# EAGLE design cerebellar V1.0 (EAGLE 9.6.2)
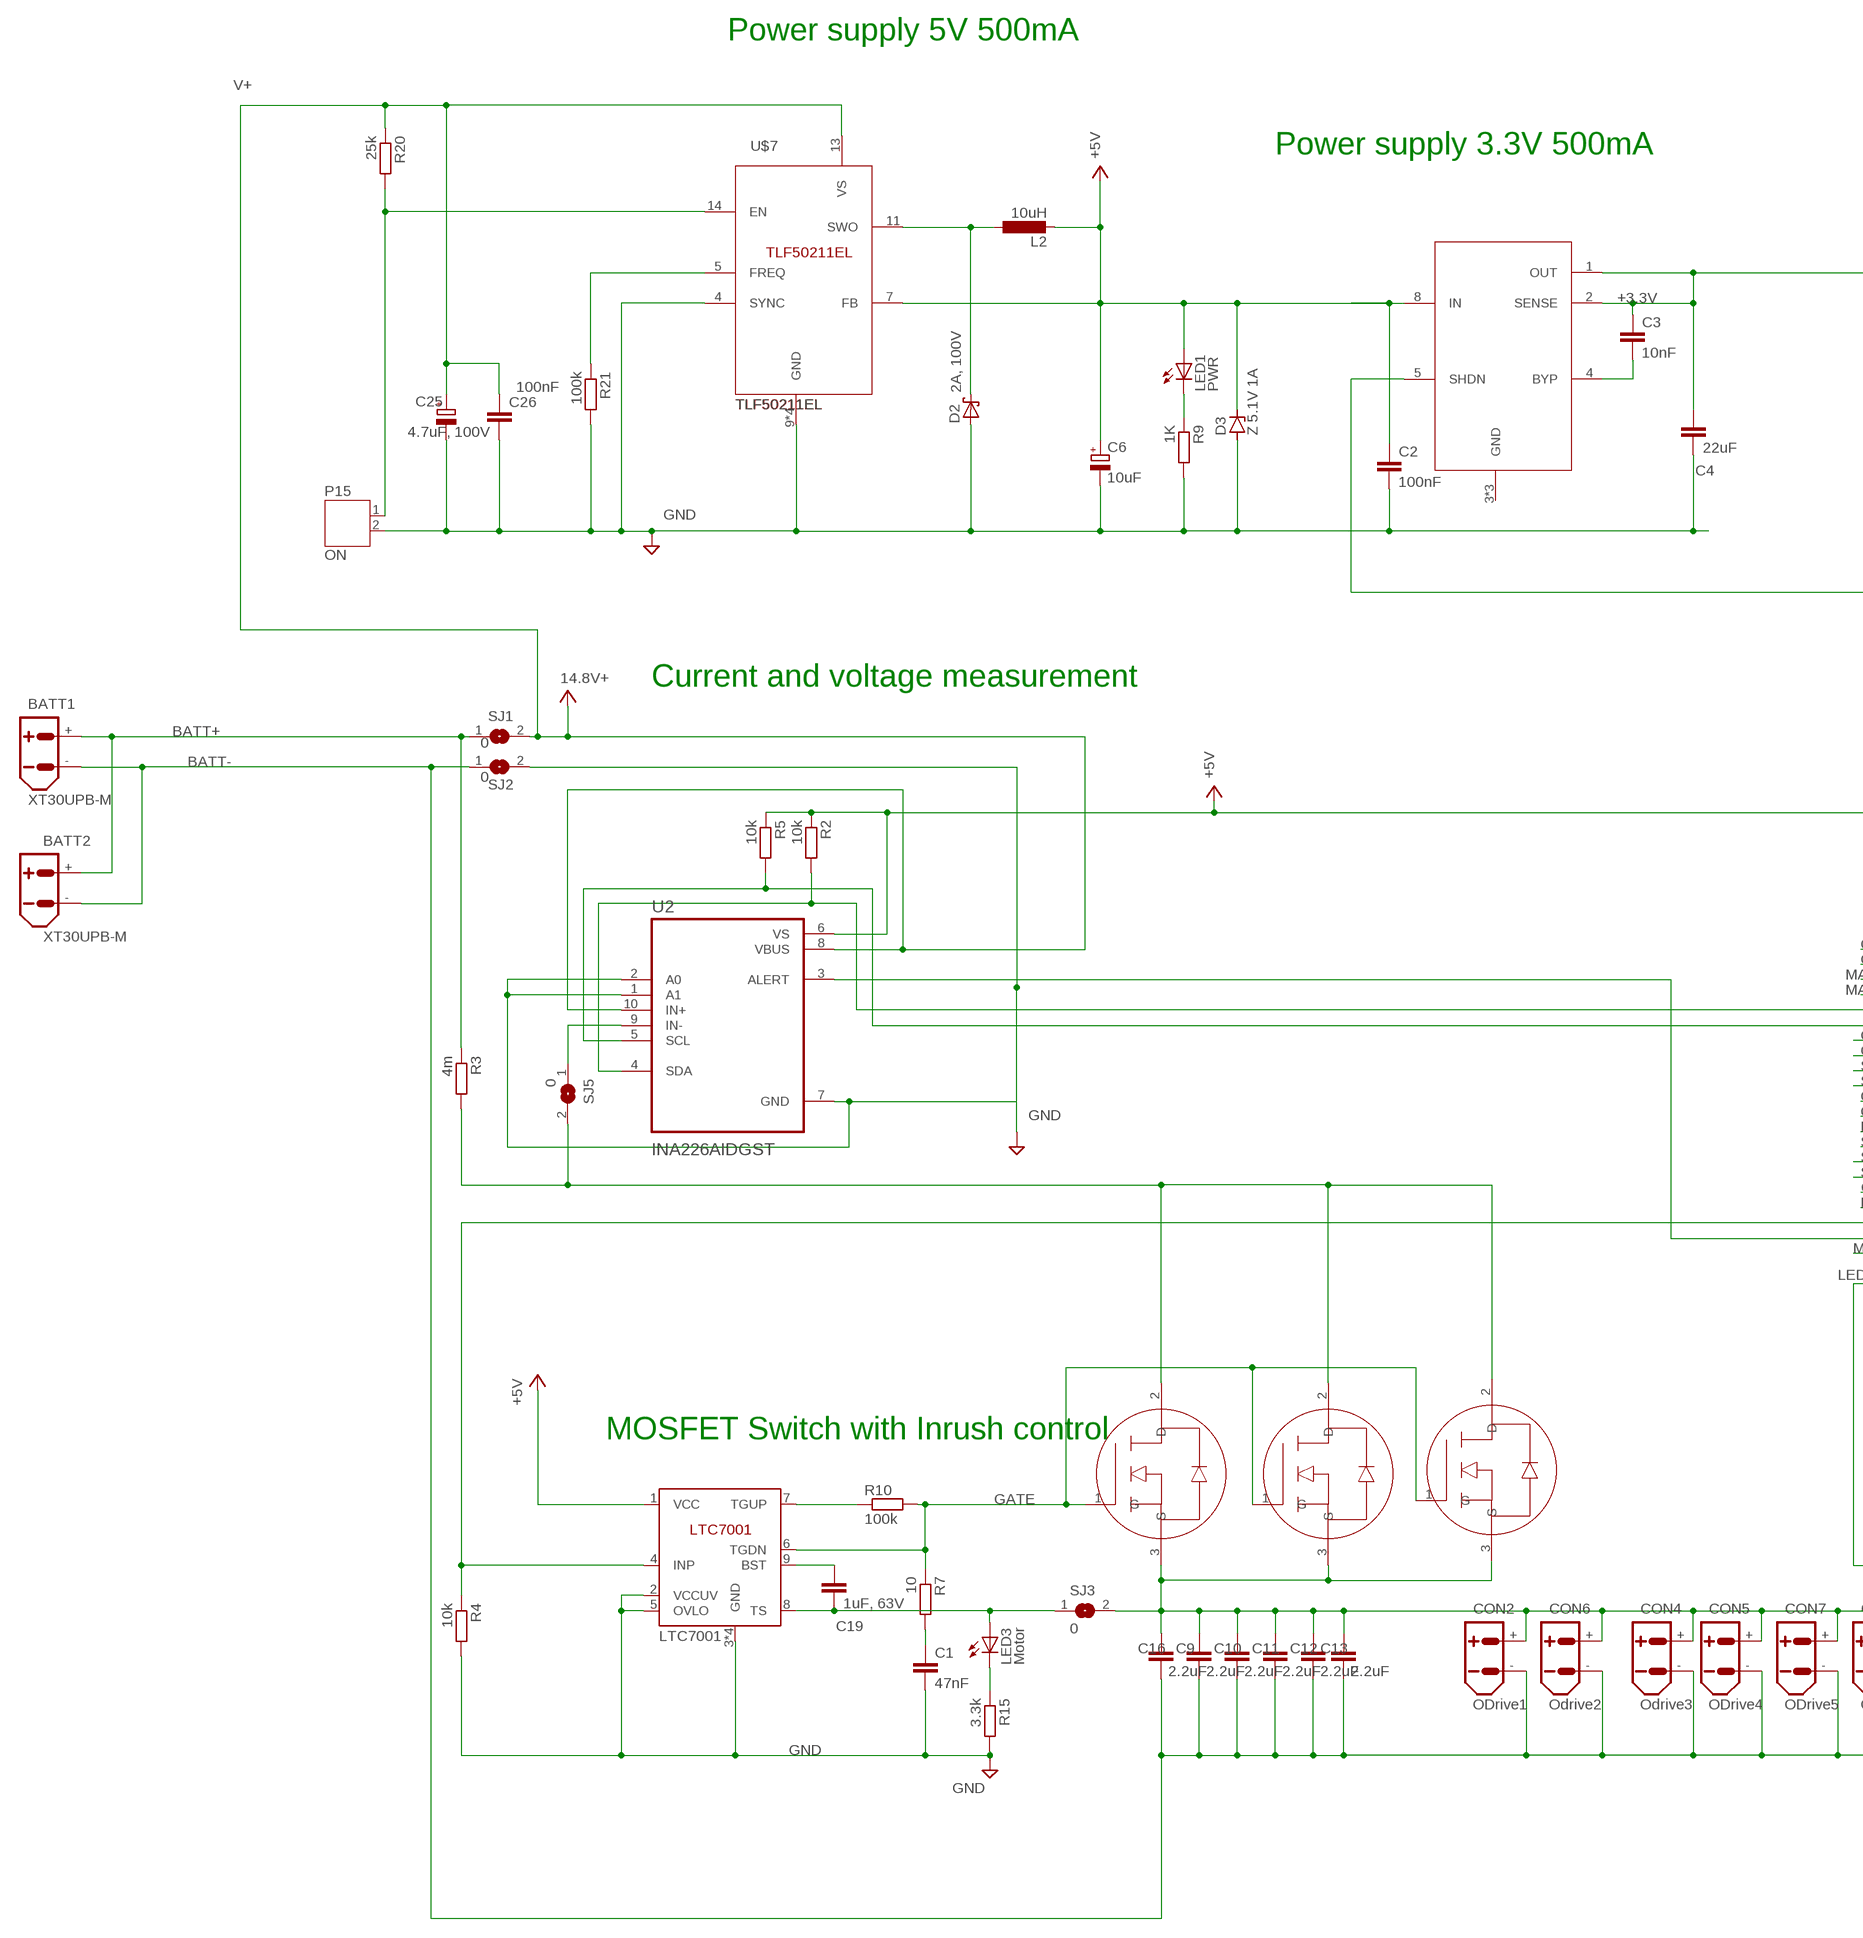
[diagram p0: schematic, sheet 1, part 1 of 2]
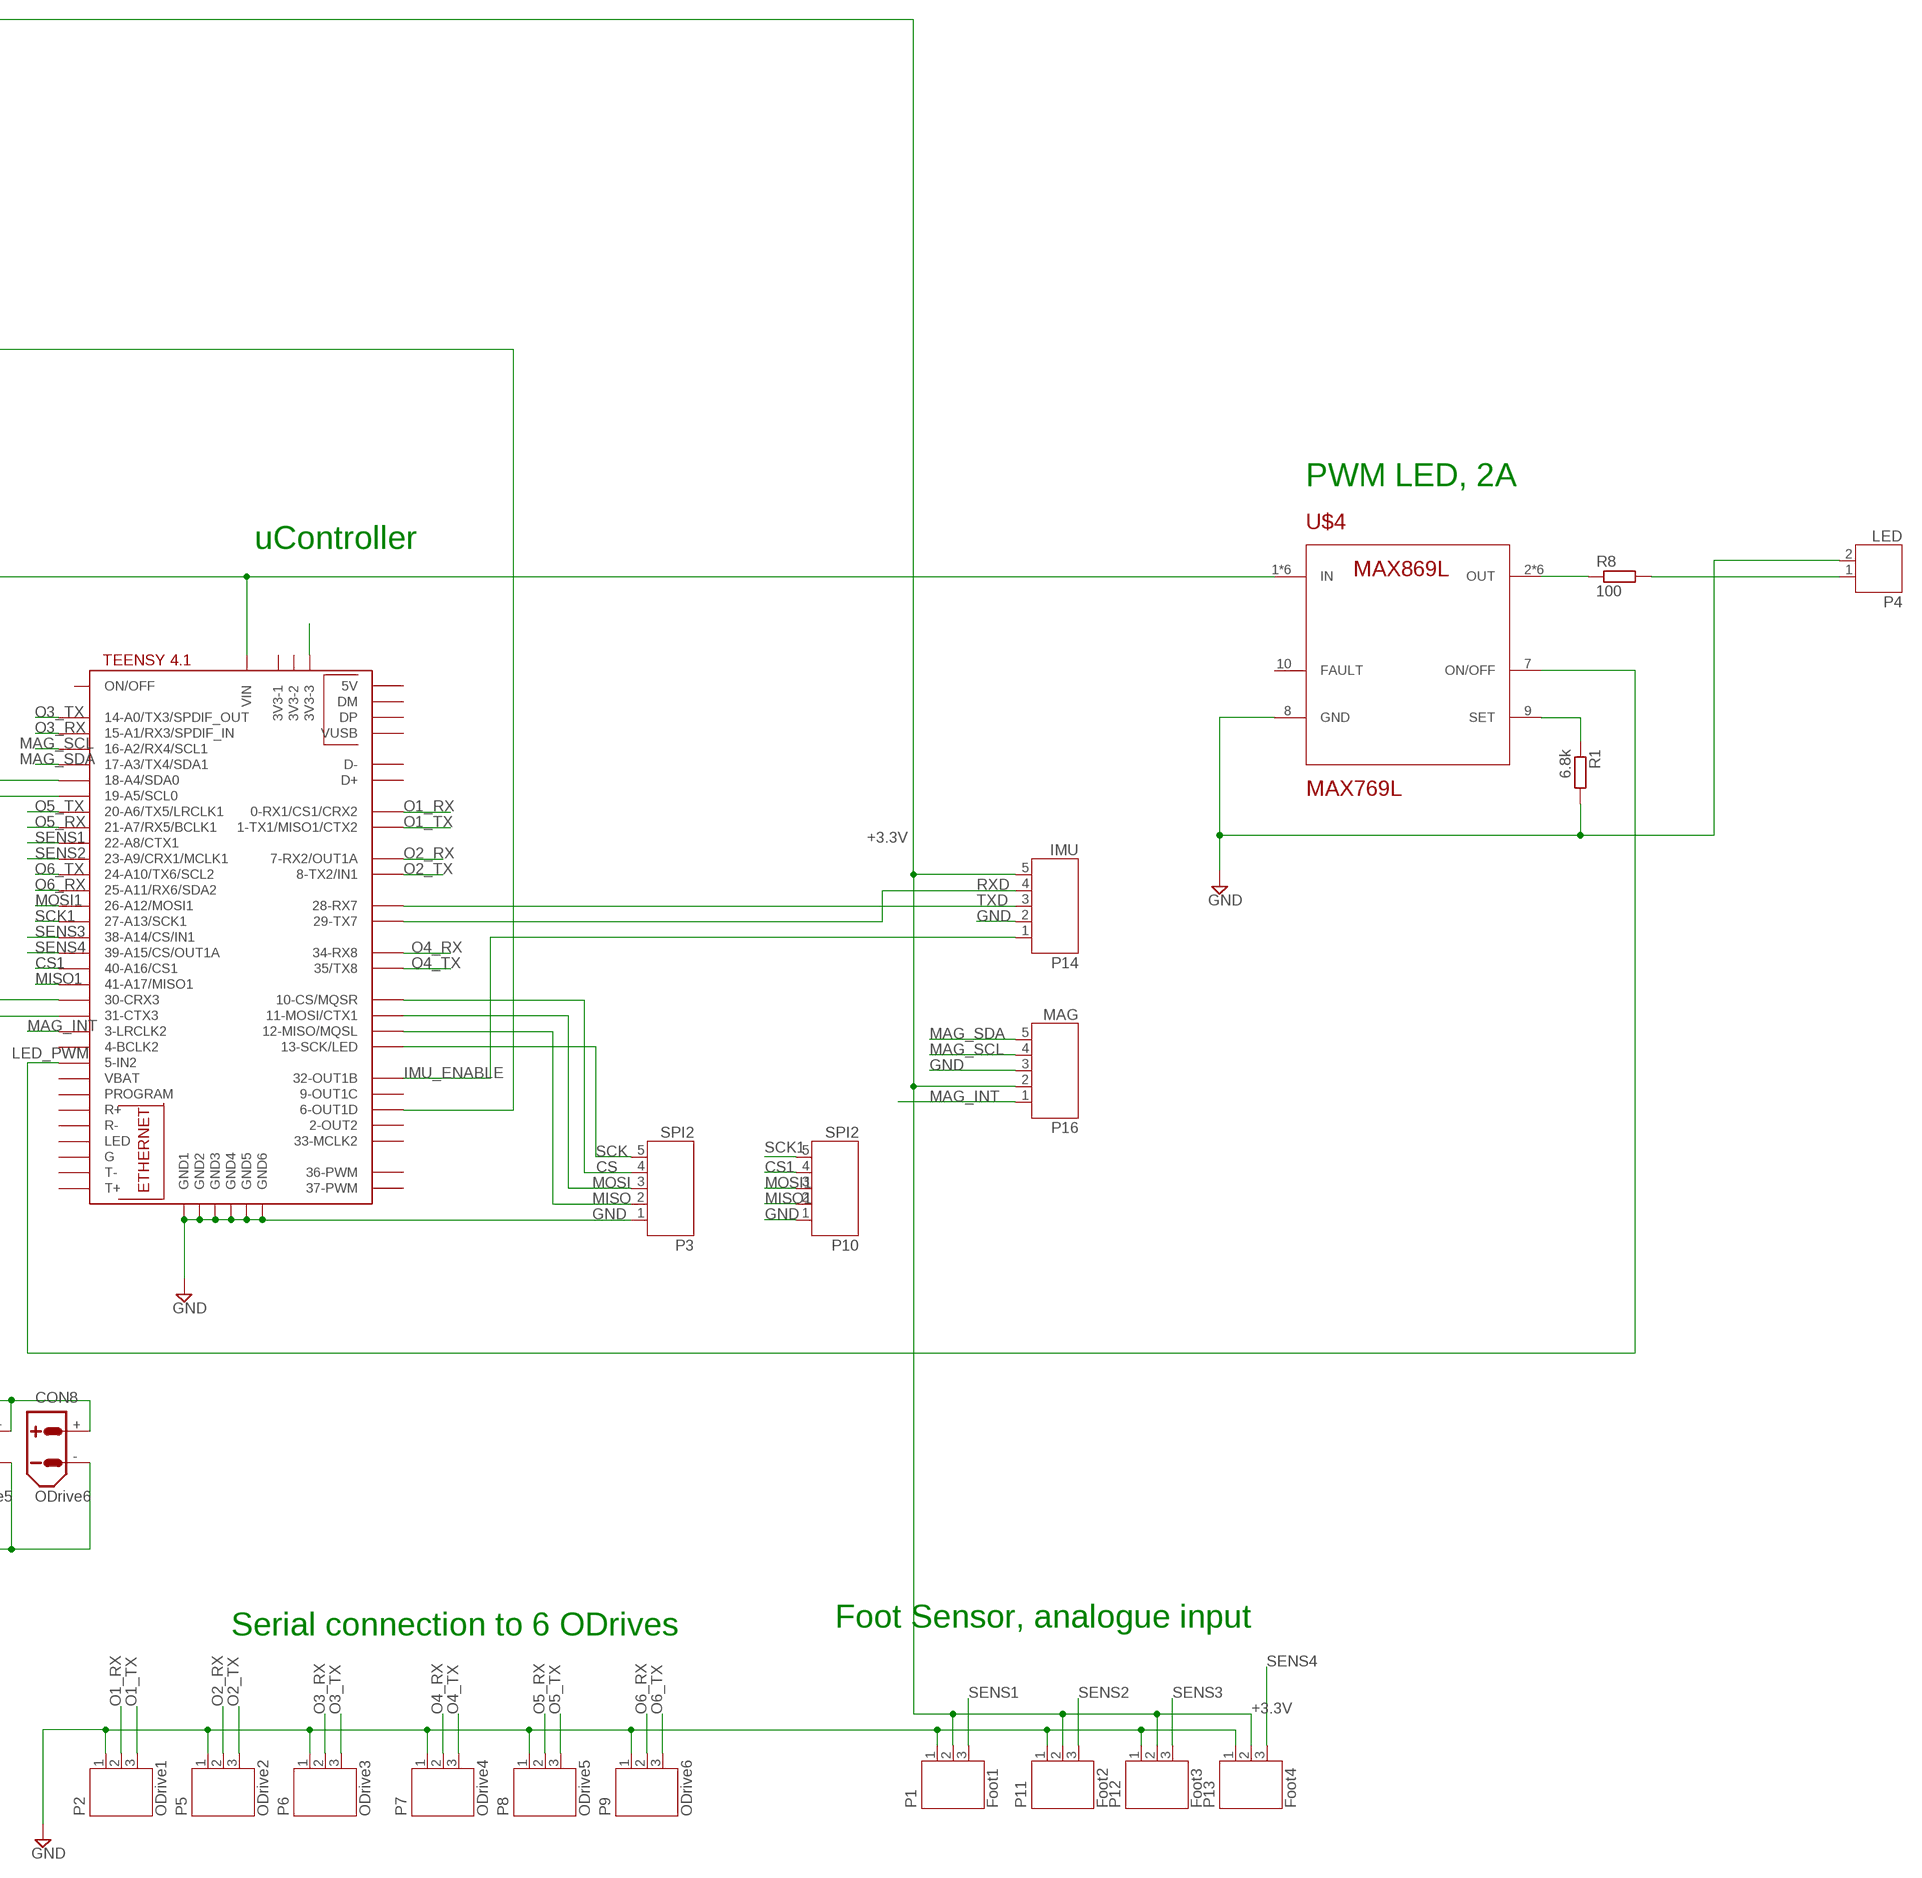
[diagram p1: schematic, sheet 1, part 2 of 2]

## Parts
BATT1  XT30UPB-M  [XT30UPB-M]
BATT2  XT30UPB-M  [XT30UPB-M]
C1  47nF  C-EU025-025X050  [C025-025X050]
C2  100nF  C-EU025-025X050  [C025-025X050]
C3  10nF  C-EU025-025X050  [C025-025X050]
C4  22uF  C-EU025-025X050  [C025-025X050]
C6  10uF  CPOL-EUE2-4  [E2-4]
C9  2.2uF  C-EU050-024X044  [C050-024X044]
C10  2.2uF  C-EU050-024X044  [C050-024X044]
C11  2.2uF  C-EU050-024X044  [C050-024X044]
C12  2.2uF  C-EU050-024X044  [C050-024X044]
C13  2.2uF  C-EU050-024X044  [C050-024X044]
C16  2.2uF  C-EU050-024X044  [C050-024X044]
C19  1uF, 63V  C-EU025-025X050  [C025-025X050]
C25  4.7uF, 100V  CPOL-EUE2-4  [E2-4]
C26  100nF  C-EU050-024X044  [C050-024X044]
CON2  ODrive1  XT30UPB-M  [XT30UPB-M]
CON4  Odrive3  XT30UPB-M  [XT30UPB-M]
CON5  ODrive4  XT30UPB-M  [XT30UPB-M]
CON6  Odrive2  XT30UPB-M  [XT30UPB-M]
CON7  ODrive5  XT30UPB-M  [XT30UPB-M]
CON8  ODrive6  XT30UPB-M  [XT30UPB-M]
D2  2A, 100V  SCHOTTKY-DIODEDO41  [DO41-10]
D3  Z 5.1V 1A  ZENER-DIODEDO41Z10  [DO41Z10]
IC3  LTC7001  [MSOP10]
L2  10uH  L-EUIRF-3  [IRF-3]
LED1  PWR  LED3MM  [LED3MM]
LED3  Motor  LED3MM  [LED3MM]
P1  Foot1  JST-PH3  [JST-PH3]
P2  ODrive1  JST-PH3  [JST-PH3]
P3  SPI2  JST-PH5  [JST-PH5]
P4  LED  JST-PH2  [JST-PH2]
P5  ODrive2  JST-PH3  [JST-PH3]
P6  ODrive3  JST-PH3  [JST-PH3]
P7  ODrive4  JST-PH3  [JST-PH3]
P8  ODrive5  JST-PH3  [JST-PH3]
P9  ODrive6  JST-PH3  [JST-PH3]
P10  SPI2  JST-PH5  [JST-PH5]
P11  Foot2  JST-PH3  [JST-PH3]
P12  Foot3  JST-PH3  [JST-PH3]
P13  Foot4  JST-PH3  [JST-PH3]
P14  IMU  JST-PH5  [JST-PH5]
P15  ON  JST-PH2  [JST-PH2]
P16  MAG  JST-PH5  [JST-PH5]
R1  6.8k  R-EU_0204/7  [0204/7]
R2  10k  R-EU_0204/7  [0204/7]
R3  4m  R-EU_R2512  [R2512]
R4  10k  R-EU_0204/7  [0204/7]
R5  10k  R-EU_0204/7  [0204/7]
R7  10  R-EU_0204/7  [0204/7]
R8  100  R-EU_0204/7  [0204/7]
R9  1K  R-EU_0204/7  [0204/7]
R10  100k  R-EU_0204/7  [0204/7]
R15  3.3k  R-EU_0204/7  [0204/7]
R20  25k  R-EU_0204/7  [0204/7]
R21  100k  R-EU_0204/7  [0204/7]
SJ1  0  SJ  [SJ]
SJ2  0  SJ  [SJ]
SJ3  0  SJ  [SJ]
SJ5  0  SJ  [SJ]
U2  INA226AIDGST  [SOP50P490X110-10N]
U$1  TEENSY41  [TEENSY41]
U$2  IRF2804  [TO-220H]
U$3  IRF2804  [TO-220H]
U$4  MAX769L  [TSSOP-16]
U$5  IRF2804  [TO-220H]
U$7  TLF50211EL  [TSSOP-14]
U$8  LT1763  [SO08]

## Nets
+3.3V: C3.1 C4.1 P1.2 P11.2 P12.2 P13.2 P14.5 P16.2 U$8.1(OUT) U$8.2(SENSE)
+5V: C2.1 C6.+ D3.C IC3.1(VCC) L2.2 LED1.A R2.1 R5.1 U2.6(VS) U$1.VIN U$4.1(IN) U$4.4(IN) U$4.5(IN) U$4.12(IN) U$4.13(IN) U$4.16(IN) U$7.7(FB) U$8.8(IN)
BATT+ [Battery]: BATT1.+ BATT2.+ R3.1 SJ1.1
BATT- [Battery]: BATT1.- BATT2.- C9.2 C10.2 C11.2 C12.2 C13.2 C16.2 CON2.- CON4.- CON5.- CON6.- CON7.- CON8.- SJ2.1
CS: P3.4 U$1.10-CS\MQSR(10-CS/MQSR)
CS1: P10.4 U$1.40-A16/CS1
DRAIN [Battery]: R3.2 SJ5.2 U$2.2(D) U$3.2(D) U$5.2(D)
GATE: IC3.6(TGDN) R7.1 R10.2 U$2.1(G) U$3.1(G) U$5.1(G)
GND: C1.2 C2.2 C4.2 C6.- C25.- C26.2 D2.A D3.A IC3.2(VCCUV) IC3.3(GND) IC3.5(OVLO) IC3.10(GND) IC3.11(GND) IC3.12(GND) P1.1 P2.1 P3.1 P4.2 P5.1 P6.1 P7.1 P8.1 P9.1 P10.1 P11.1 P12.1 P13.1 P14.2 P15.2 P16.3 R1.2 R4.2 R9.2 R15.2 R21.2 SJ2.2 U2.1(A1) U2.2(A0) U2.7(GND) U$1.GND1 U$1.GND2 U$1.GND3 U$1.GND4 U$1.GND5 U$1.GND6 U$4.8(GND) U$7.4(SYNC) U$7.9(GND) U$7.10(GND) U$7.15(GND) U$7.16(GND)
IMU_ENABLE: P14.1 U$1.32-OUT1B
LED_PWM: U$1.5-IN2 U$4.7(ON/OFF)
MAG_INT: P16.1 U$1.3-LRCLK2
MAG_SCL: P16.4 U$1.16-A2/RX4/SCL1
MAG_SDA: P16.5 U$1.17-A3/TX4/SDA1
MISO: P3.2 U$1.12-MISO/MQSL
MISO1: P10.2 U$1.41-A17/MISO1
MOSI: P3.3 U$1.11-MOSI/CTX1
MOSI1: P10.3 U$1.26-A12/MOSI1
N$1: C1.1 R7.2
N$2: R1.1 U$4.9(SET)
N$3: P4.1 R8.2
N$4: IC3.7(TGUP) R10.1
N$5: U2.3(ALERT) U$1.31-CTX3
N$6: R8.1 U$4.2(OUT) U$4.3(OUT) U$4.6(OUT) U$4.11(OUT) U$4.14(OUT) U$4.15(OUT)
N$7: U$1.3V3-3
N$8: C3.2 U$8.4(BYP)
N$9: U$1.6-OUT1D U$8.5(SHDN)
N$10: IC3.4(INP) R4.1 U$1.30-CRX3
N$17: R5.2 U2.5(SCL) U$1.19-A5/SCL0
N$18: SJ5.1 U2.9(IN-)
N$22: R2.2 U2.4(SDA) U$1.18-A4/SDA0
N$24: C19.1 IC3.9(BST)
N$26: C19.2 IC3.8(TS) LED3.A SJ3.1
N$30: LED3.K(C) R15.1
N$39: LED1.K(C) R9.1
N$42: D2.C L2.1 U$7.11(SWO)
N$46: R21.1 U$7.5(FREQ)
N$47: P15.1 R20.2 U$7.14(EN)
O1_RX: P2.2 U$1.0-RX1/CS1/CRX2
O1_TX: P2.3 U$1.1-TX1/MISO1/CTX2
O2_RX: P5.2 U$1.7-RX2/OUT1A
O2_TX: P5.3 U$1.8-TX2/IN1
O3_RX: P6.2 U$1.15-A1/RX3/SPDIF_IN
O3_TX: P6.3 U$1.14-A0/TX3/SPDIF_OUT
O4_RX: P7.2 U$1.34-RX8
O4_TX: P7.3 U$1.35-TX8(35/TX8)
O5_RX: P8.2 U$1.21-A7/RX5/BCLK1
O5_TX: P8.3 U$1.20-A6/TX5/LRCLK1
O6_RX: P9.2 U$1.25-A11/RX6/SDA2
O6_TX: P9.3 U$1.24-A10/TX6/SCL2
POWER+ [Battery]: C9.1 C10.1 C11.1 C12.1 C13.1 C16.1 CON2.+ CON4.+ CON5.+ CON6.+ CON7.+ CON8.+ SJ3.2 U$2.3(S) U$3.3(S) U$5.3(S)
RXD: P14.4 U$1.29-TX7
SCK: P3.5 U$1.13-SCK/LED
SCK1: P10.5 U$1.27-A13/SCK1
SENS1: P1.3 U$1.22-A8/CTX1
SENS2: P11.3 U$1.23-A9/CRX1/MCLK1
SENS3: P12.3 U$1.38-A14/CS/IN1
SENS4: P13.3 U$1.39-A15/CS/OUT1A
TXD: P14.3 U$1.28-RX7
V+: C25.+ C26.1 R20.1 SJ1.2 U2.8(VBUS) U2.10(IN+) U$7.13(VS) ; supply symbol labelled 14.8V+
Unconnected: U$1.2-OUT2 U$1.3V3-1 U$1.3V3-2 U$1.4-BCLK2 U$1.9-OUT1C U$1.33-MCLK2 U$1.36-PWM U$1.37-PWM U$1.+5V(5V) U$1.D+ U$1.D- U$1.DM U$1.DP U$1.G U$1.LED U$1.ON/OFF U$1.PROGRAM U$1.R+ U$1.R- U$1.T+ U$1.T- U$1.VBAT U$1.VUSB U$4.10(FAULT) U$8.3(GND) U$8.6(GND) U$8.7(GND)

## Notes on the sheet
- Power supply 5V 500mA
- Power supply 3.3V 500mA
- Current and voltage measurement
- PWM LED, 2A
- uController
- MOSFET Switch with Inrush control
- Serial connection to 6 ODrives | Foot Sensor, analogue input

## Library data of the parts
BATT1 BATT2 CON2 CON4-CON8 = amass:XT30: AMASS XT30 connector Store in Japan AMASS XT30 connector <https://szc.jp/ams-xt30>
C1-C4 C9-C13 C16 C19 C26 = rcl:C-EU: CAPACITOR, European symbol; SPICEPREFIX: C
C6 C25 = rcl:CPOL-EU: POLARIZED CAPACITOR, European symbol; SPICEPREFIX: C
D2 = adafruit:SCHOTTKY-DIODE: Schottky Diode
D3 = diode:ZENER-DIODE: Z-Diode
IC3 = LTC7001:LTC7001: Fast 150V High Side NMOS Static Switch Driver Source: https://www.analog.com/en/products/ltc7001.html; MPN: AD7992BRMZ-0; OC_FARNELL: 1078311; OC_NEWARK: 31M4422
L2 = rcl:L-EU: INDUCTOR, European symbol; SPICEPREFIX: L
LED1 LED3 = adafruit:LED: LED OSRAM: - CHIPLED LG R971, LG N971, LY N971, LG Q971, LY Q971, LO R971, LY R971 LH N974, LH R974 LS Q976, LO Q976, LY Q976 LO Q996 - Hyper CHIPLED LW Q18S LB Q993, LB Q99A, LB R99A - SideLED LS A670, LO A670, LY A670, LG A670, LP A670 LB A673, LV A673, LT A673, LW A673 LH A674 LY A675 LS A676, LA A676, LO A676, LY A676, LW A676 LS A679, LY A679, LG A679 - Hyper Micro SIDELED® LS Y876, LA Y876, LO Y876, LY Y876 LT Y87S - SmartLED LW L88C, LW L88S LB L89C, LB L89S, LG L890 LS L89K, LO L89K, LY L89K LS L896, LA L896, LO L896, LY L896 - TOPLED LS T670, LO T670, LY T670, LG T670, LP T670 LSG T670, LSP T670, LSY T670, LOP T670, LYG T670 LG T671, LOG T671, LSG T671 LB T673, LV T673, LT T673, LW T673 LH T674 LS T676, LA T676, LO T676, LY T676, LB T676, LH T676, LSB T676, LW T676 LB T67C, LV T67C, LT T67C, LS T67K, LO T67K, LY T67K, LW E67C LS E67B, LA E67B, LO E67B, LY E67B, LB E67C, LV E67C, LT E67C LW T67C LS T679, LY T679, LG T679 LS T770, LO T770, LY T770, LG T770, LP T770 LB T773, LV T773, LT T773, LW T773 LH T774 LS E675, LA E675, LY E675, LS T675 LS T776, LA T776, LO T776, LY T776, LB T776 LHGB T686 LT T68C, LB T68C - Hyper Mini TOPLED® LB M676 - Mini TOPLED Santana® LG M470 LS M47K, LO M47K, LY M47K Source: http://www.osram.convergy.de/
P1 P2 P5-P9 P11-P13 = jst-ph:JST-PH3
P3 P10 P14 P16 = jst-ph:JST-PH5
P4 P15 = jst-ph:JST-PH2
R1 R2 R4 R5 R7-R10 R15 R20 R21 = rcl:R-EU_: RESISTOR, European symbol; SPICEPREFIX: R
R3 = rcl:R-EU_: RESISTOR, European symbol; DIGIKEY: 541-WSK25124L000FEACT-ND; LINK: https://octopart.com/wsk25124l000fea-vishay-41934978?r=sp; MOUSER: 71-WSK25124L000FEA; SPICEPREFIX: R
SJ1-SJ3 SJ5 = jumper:SJ: SMD solder JUMPER
U2 = INA226AIDGST:INA226AIDGST: Check availability <https://pricing.snapeda.com/parts/INA226AIDGST/Texas%20Instruments/view-part?ref=eda>; AVAILABILITY: In Stock; DESCRIPTION: 36V, 16-bit, ultra-precise i2c output current/voltage/power monitor w/alert; MF: Texas Instruments; MP: INA226AIDGST; PACKAGE: VSSOP-10 Texas Instruments; PRICE: None; PURCHASE-URL: https://pricing.snapeda.com/search/part/INA226AIDGST/?ref=eda
U$1 = teensy:TEENSY41
U$2 U$3 U$5 = IRF2804:IRF2804: N-Channel Power MOSFET
U$4 = MAX869:MAX769L: MAX869L 2A, Current-Limited, High-Side P-Channel Switch with Thermal Shutdown
U$7 = TLF50211EL:TLF50211EL: TLF50211EL 2.2 MHz Step-Down Regulator 500 mA, 5 V, low quiescent current https://www.infineon.com/dgdl/Infineon-TLF50211EL-DS-v01_10-EN.pdf?fileId=5546d46258fc0bc1015969d2af9641e9
U$8 = LT1763:LT1763

## Net classes
0 default: width 0.254 mm
1 Battery: width 1.575 mm

## Board
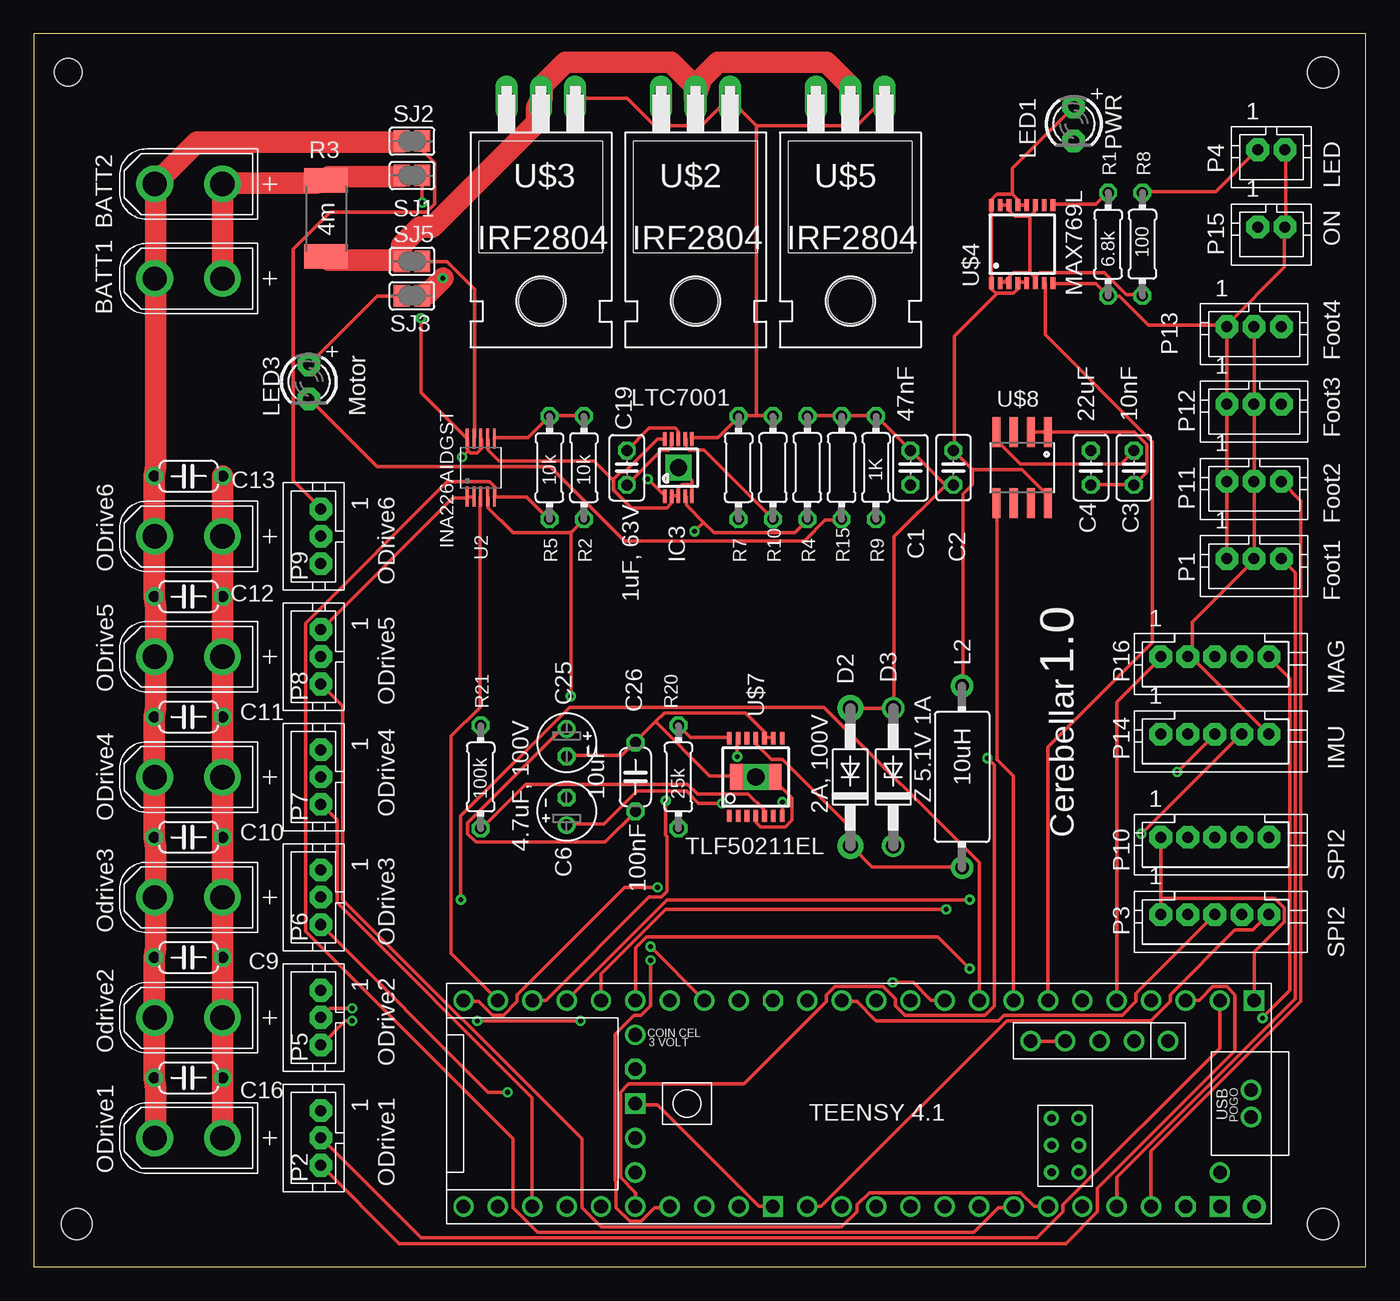
[diagram p2: board, top side]
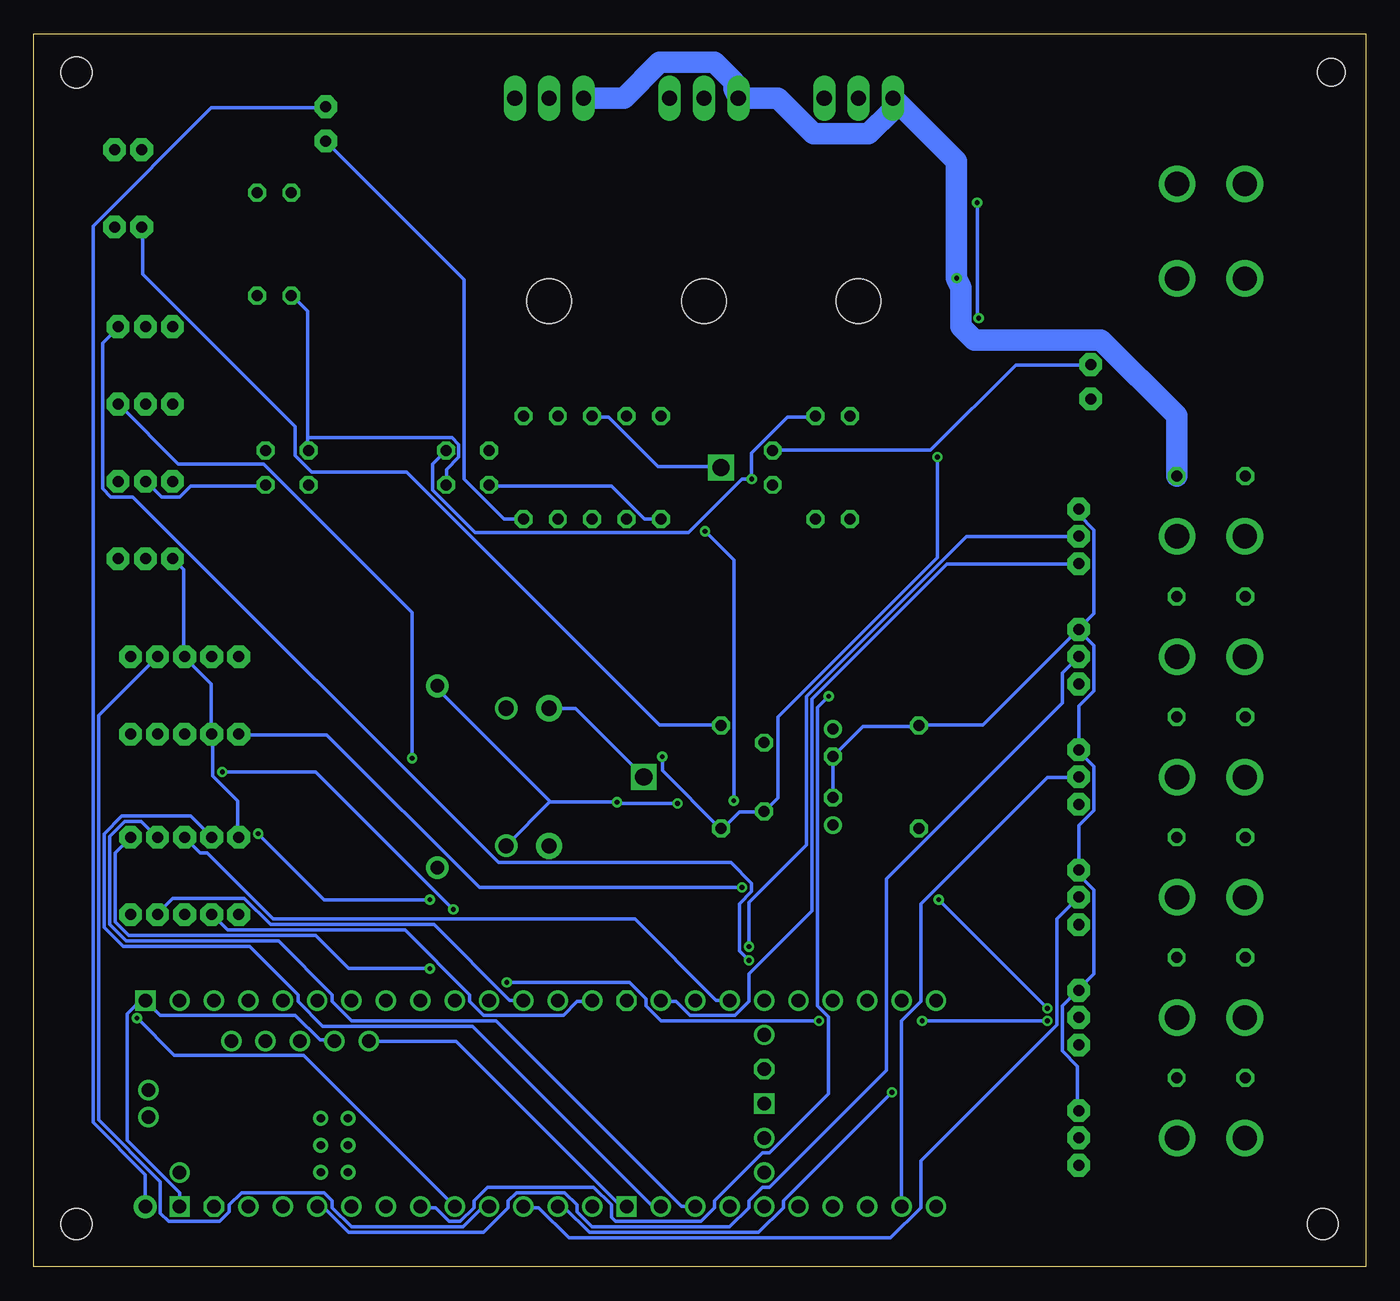
[diagram p3: board, bottom side, seen from below]

Size 98.41 x 91.11 mm. Coordinates in mm from the lower left corner, seen from the top.
Outline: 0,0 98.41,0 98.41,91.11 0,91.11 0,0
Copper layers (1*16): Top 0.035mm / dielectric 1.5mm / Bottom 0.035mm
Design rules "default": minimum track width 6mil, minimum drill 0.35mm, track to track 6mil, track to pad 6mil, pad to pad 6mil, via to via 6mil, smd to smd 6mil, copper to edge 40mil, drill to drill 6mil, minimum pad ring 10mil, minimum via ring 8mil, stop-mask expansion 4mil, vias tented up to drill 0mil, thermal gap 10mil
Holes 2.03 mm at 2.54,88.27
Holes 2.29 mm at 3.17,3.17 95.25,88.27 95.25,3.17

### Footprints (pad centres in the part's own frame; a part is rotated, then mirrored left to right if it is on the bottom)
XT30UPB-M = drill 1.8: + 2.5,0; - -2.5,0
C025-025X050 = drill 0.813 octagon: 1 -1.27,0; 2 1.27,0
E2-4 = drill 0.813 pad 1.27: + -1.016,0 | drill 0.813 pad 1.27 octagon: - 1.016,0
C050-024X044 = drill 0.813 octagon: 1 -2.54,0; 2 2.54,0
DO41-10 = drill 1.118 pad 1.93: A 5.08,0; C -5.08,0
DO41Z10 = drill 1.118: A 5.08,0; C -5.08,0
MSOP10 = smd 0.25 x 1: 1 -1,-2.113; 2 -0.5,-2.113; 3 0,-2.113; 4 0.5,-2.113; 5 1,-2.113; 6 1,2.113; 7 0.5,2.113; 8 0,2.113; 9 -0.5,2.113; 10 -1,2.113 | drill 1.27 square: 11 0,0 | smd 1.524 x 1.524: 12 0,0
IRF-3 = drill 1 pad 1.676: 1 -6.705,0; 2 6.73,0
LED3MM = drill 0.813 pad 1.676 octagon: A -1.27,0; K 1.27,0
JST-PH3 = drill 0.813 pad 1.676 octagon: 1 2.016,-1.524; 2 0.016,-1.524; 3 -2.016,-1.524
JST-PH5 = drill 0.813 pad 1.676 octagon: 1 5,0; 2 3,0; 3 1,0; 4 -1,0; 5 -3,0
JST-PH2 = drill 0.813 pad 1.676 octagon: 1 1,0; 2 -1,0
0204/7 = drill 0.813 octagon: 1 -3.81,0; 2 3.81,0
R2512 = smd 1.8 x 3.2: 1 -2.8,0; 2 2.8,0
SJ = smd 1.168 x 1.6: 1 -0.762,0; 2 0.762,0
SOP50P490X110-10N = smd 1.47 x 0.28: 1 -2.15,1; 2 -2.15,0.5; 3 -2.15,0; 4 -2.15,-0.5; 5 -2.15,-1; 6 2.15,-1; 7 2.15,-0.5; 8 2.15,0; 9 2.15,0.5; 10 2.15,1
TEENSY41 = drill 1: 0-RX1/CS1/CRX2 -27.94,-7.62; 1-TX1/MISO1/CTX2 -25.4,-7.62; 2-OUT2 -22.86,-7.62; 3-LRCLK2 -20.32,-7.62; 4-BCLK2 -17.78,-7.62; 5-IN2 -15.24,-7.62; 6-OUT1D -12.7,-7.62; 7-RX2/OUT1A -10.16,-7.62; 8-TX2/IN1 -7.62,-7.62; 9-OUT1C -5.08,-7.62; 10-CS\MQSR -2.54,-7.62; 11-MOSI/CTX1 0,-7.62; 12-MISO/MQSL 2.54,-7.62; 13-SCK/LED 2.54,7.62; 14-A0/TX3/SPDIF_OUT 0,7.62; 15-A1/RX3/SPDIF_IN -2.54,7.62; 16-A2/RX4/SCL1 -5.08,7.62; 17-A3/TX4/SDA1 -7.62,7.62; 18-A4/SDA0 -10.16,7.62; 19-A5/SCL0 -12.7,7.62; 20-A6/TX5/LRCLK1 -15.24,7.62; 21-A7/RX5/BCLK1 -17.78,7.62; 22-A8/CTX1 -20.32,7.62; 23-A9/CRX1/MCLK1 -22.86,7.62; 24-A10/TX6/SCL2 7.62,-7.62; 25-A11/RX6/SDA2 10.16,-7.62; 26-A12/MOSI1 12.7,-7.62; 27-A13/SCK1 15.24,-7.62; 28-RX7 17.78,-7.62; 29-TX7 20.32,-7.62; 30-CRX3 22.86,-7.62; 31-CTX3 25.4,-7.62; 32-OUT1B 27.94,-7.62; 33-MCLK2 27.94,7.62; 34-RX8 25.4,7.62; 35-TX8 22.86,7.62; 36-PWM 20.32,7.62; 37-PWM 17.78,7.62; 38-A14/CS/IN1 15.24,7.62; 39-A15/CS/OUT1A 12.7,7.62; 40-A16/CS1 10.16,7.62; 41-A17/MISO1 7.62,7.62; +5V -24.13,-4.62; D+ -30.25,-1; D- -30.25,1; DM -21.59,-4.62; DP -19.05,-4.62; GND4 -16.51,-4.62; GND5 -13.97,-4.62; ON/OFF 15.24,5.08; PROGRAM 15.24,2.54; VBAT 15.24,-5.08; VUSB -27.94,5.08 | drill 1 octagon: 3V3-1 5.08,-7.62; 3V3-2 15.24,-2.54; 3V3-3 -25.4,7.62 | drill 0.6: G -15.51,3.08; LED -17.51,3.08; R+ -17.51,5.08; R- -15.51,5.08; T+ -15.51,1.08; T- -17.51,1.08 | drill 1 square: GND1 -30.48,-7.62; GND2 15.24,0; GND3 5.08,7.62; GND6 -27.94,7.62 | drill 1 pad 1.676: VIN -30.48,7.62
TO-220H = drill 1.118 long: 1 -2.54,-7.62; 2 0,-7.62; 3 2.54,-7.62 | hole 3.302: 0,7.366
TSSOP-16 = smd 0.9 x 0.35: 1 -2.875,2.275; 2 -2.875,1.625; 3 -2.875,0.975; 4 -2.875,0.325; 5 -2.875,-0.325; 6 -2.875,-0.975; 7 -2.875,-1.625; 8 -2.875,-2.275; 9 2.875,-2.275; 10 2.875,-1.625; 11 2.875,-0.975; 12 2.875,-0.325; 13 2.875,0.325; 14 2.875,0.975; 15 2.875,1.625; 16 2.875,2.275
TSSOP-14 = smd 0.9 x 0.35: 1 -2.875,1.95; 2 -2.875,1.3; 3 -2.875,0.65; 4 -2.875,0; 5 -2.875,-0.65; 6 -2.875,-1.3; 7 -2.875,-1.95; 8 2.875,-1.95; 9 2.875,-1.3; 10 2.875,-0.65; 11 2.875,0; 12 2.875,0.65; 13 2.875,1.3; 14 2.875,1.95 | smd 1.93 x 3.81: 15 0,0 | drill 1.27 square: 16 0,0
SO08 = smd 0.61 x 2.21: 1 -1.905,-2.616; 2 -0.635,-2.616; 3 0.635,-2.616; 4 1.905,-2.616; 5 1.905,2.616; 6 0.635,2.616; 7 -0.635,2.616; 8 -1.905,2.616

### Placement (x,y rotation side)
BATT1  11.43,73.03 0 top
BATT2  11.43,80.01 0 top
C1  64.77,59.05 90 top
C2  67.94,59.05 270 top
C3  81.28,59.05 90 top
C4  78.1,59.05 90 top
C6  39.37,33.66 90 top
C9  11.43,22.86 180 top
C10  11.43,31.75 180 top
C11  11.43,40.64 180 top
C12  11.43,49.53 180 top
C13  11.43,58.42 180 top
C16  11.43,13.97 180 top
C19  43.82,59.05 90 top
C25  39.37,38.73 270 top
C26  44.45,36.2 90 top
CON2  11.43,9.53 0 top
CON4  11.43,27.3 0 top
CON5  11.43,36.2 0 top
CON6  11.43,18.41 0 top
CON7  11.43,45.09 0 top
CON8  11.43,53.98 0 top
D2  60.33,36.2 90 top
D3  63.5,36.2 90 top
IC3  47.62,59.05 0 top
L2  68.58,36.2 90 top
LED1  76.83,84.45 270 top
LED3  20.32,65.41 270 top
P1  90.17,50.8 180 top
P2  19.69,9.53 90 top
P3  88.27,26.04 180 top
P4  91.44,82.55 180 top
P5  19.69,18.41 90 top
P6  19.69,27.3 90 top
P7  19.69,36.2 90 top
P8  19.69,45.09 90 top
P9  19.69,53.98 90 top
P10  88.27,31.75 180 top
P11  90.17,56.52 180 top
P12  90.17,62.23 180 top
P13  90.17,67.94 180 top
P14  88.27,39.37 180 top
P15  91.44,76.83 180 top
P16  88.27,45.09 180 top
R1  79.38,75.56 270 top
R2  40.64,59.05 270 top
R3  21.59,77.47 270 top
R4  57.15,59.05 90 top
R5  38.1,59.05 270 top
R7  52.07,59.05 270 top
R8  81.91,75.56 90 top
R9  62.23,59.05 90 top
R10  54.61,59.05 90 top
R15  59.69,59.05 90 top
R20  47.62,36.2 90 top
R21  33.02,36.2 90 top
SJ1  27.94,80.64 0 top
SJ2  27.94,83.19 0 top
SJ3  27.94,71.75 0 top
SJ5  27.94,74.3 180 top
U2  33.02,59.05 90 top
U$1  59.69,12.06 180 top
U$2  48.9,78.74 180 top
U$3  37.46,78.74 180 top
U$4  73.02,75.56 90 top
U$5  60.33,78.74 180 top
U$7  53.34,36.2 90 top
U$8  73.02,59.05 180 top

### Tracks (layer width: path | path; a pad name or v marks a point on that pad's centre or on a via)
+3.3V
  Top 0.254: P14.5 91.19,39.42 85.6,45.01 85.29,45.01 P16.2 85.6,45.11 85.6,47.65 90.17,52.22 P1.2 90.17,52.32 90.17,58.01 P11.2 90.17,58.12 90.17,63.7 P12.2 90.17,63.8 90.17,69.39 P13.2 | U$8.2 U$8.1 81.33,61.67 82.24,60.76 82.24,58.73 81.33,57.81 C3.1 81.23,57.81 78.18,57.81 C4.1
  Bottom 0.254: C3.1 81.33,57.71 86.82,57.71 87.63,56.9 88.95,56.9 90.07,58.01 P11.2
+5V  (via drill 0.35)
  Top 0.254: v55.32,34.34 55.32,33.33 U$7.7 | v50.85,34.24 49.12,34.24 48.21,35.15 44.55,35.15 42.11,32.72 39.37,32.72 C6.+ | U2.6 34.09,61.27 36.52,61.27 38.05,62.79 R5.1 38.15,62.89 40.59,62.89 R2.1 | v45.36,58.22 46.58,57 IC3.1 | U$8.8 74.93,57 73,58.93 69.34,58.93 | 69.34,58.93 C2.1 68.02,60.35 68.02,68.78 71.07,71.83 71.07,71.93 | 71.07,71.93 70.76,72.24 70.76,72.64 U$4.1 70.76,72.75 70.76,78.33 U$4.16 70.76,78.54 70.76,78.84 71.17,79.25 72.29,79.25 | 71.07,71.93 72.39,71.93 72.69,72.24 72.69,72.64 U$4.4 72.8,72.75 73.3,72.75 U$4.5 | 72.29,79.25 72.69,78.84 72.69,78.54 U$4.13 72.8,78.44 73.3,78.44 U$4.12 | 72.29,79.25 72.29,81.18 LED1.A | 69.34,58.93 69.34,57.81 68.63,57.1 68.63,42.98 L2.2
  Bottom 0.254: 60.3,34.34 v55.32,34.34 55.32,34.24 v50.85,34.24 | 60.3,34.34 63.45,31.19 D3.C | L2.2 68.53,42.88 68.53,42.67 60.3,34.44 60.3,34.34 | R2.1 40.69,62.79 42.72,62.79 45.36,60.15 v45.36,58.22 46.08,58.22 50.04,54.25 65.79,54.25 68.94,57.4 68.94,59.33 C2.1 | U$1.VIN 90.17,6.81 94.03,10.67 94.03,76.91 85.29,85.65 76.86,85.65 LED1.A
BATT+
  Top 1.575: SJ1.1 27.18,80.57 21.79,80.57 21.59,80.37 R3.1 20.88,80.06 13.97,80.06 BATT2.+ 13.97,79.25 13.97,73.05 BATT1.+
BATT-
  Top 1.575: SJ2.1 27.18,83.11 12.04,83.11 8.99,80.06 BATT2.- 8.99,79.25 8.99,73.05 BATT1.- 8.99,72.24 8.99,59.13 C13.2 8.89,54.76 CON8.- 8.89,53.95 C12.2 8.99,48.77 8.99,45.11 CON7.- 8.99,44.3 8.99,41.35 C11.2 8.89,36.98 CON5.- 8.89,36.17 C10.2 8.99,30.99 8.99,27.33 CON4.- 8.99,26.52 8.99,23.57 C9.2 8.89,19.2 CON6.- 8.89,18.39 C16.2 8.99,13.21 8.99,9.55 CON2.-
CS
  Bottom 0.254: U$1.10-CS\MQSR 62.23,19.71 63.25,19.71 68.83,25.3 80.92,25.3 82.85,27.23 88.14,27.23 89.26,26.11 P3.4
CS1
  Bottom 0.254: U$1.40-A16/CS1 49.53,4.47 50.55,4.47 64.26,18.19 74.93,18.19 76.35,19.61 76.35,20.12 80.31,24.08 91.59,24.08 92.81,25.3 92.81,31.8 91.69,32.92 90.47,32.92 89.36,31.8 P10.4
DRAIN
  Top 1.575: R3.2 21.59,74.57 21.79,74.37 27.18,74.37 SJ5.2 27.18,75.49 28.5,76.81 29.41,76.81 37.13,84.53 37.13,85.65 U$3.2 37.54,86.36 37.54,87.27 39.27,89 47.09,89 48.82,87.27 48.82,86.36 U$2.2 49.33,87.78 50.55,89 58.57,89 60.3,87.27 60.3,86.36 U$5.2
GATE
  Top 0.254: IC3.6 48.72,61.27 50.55,61.27 52.07,62.79 R7.1 52.17,62.89 53.39,62.89 | 53.39,62.89 54.61,62.89 R10.2 | U$3.1 43.84,86.36 45.87,84.33 49.33,84.33 51.36,86.36 U$2.1 51.46,86.26 53.39,84.33 | 53.39,84.33 60.81,84.33 62.84,86.36 U$5.1 | 53.39,84.33 53.39,62.89
GND
  Top 0.254: D2.A 60.4,41.25 63.45,41.25 D3.A 63.55,41.35 63.55,53.95 67.31,57.71 C2.2 67.92,57.81 67.31,57.81 64.87,60.25 C1.2 64.77,60.35 62.23,62.89 R9.2 62.13,62.89 59.79,62.89 R15.2 59.69,62.89 57.15,62.89 R4.2 | U$7.4 53.39,33.22 53.39,32.82 53.7,32.51 55.52,32.51 56.03,33.02 56.03,34.65 54.51,36.17 53.39,36.17 U$7.16 53.29,36.27 49.94,36.27 45.92,40.28 | U$7.9 54.61,39.12 54,39.12 U$7.10 54,39.22 54,39.52 52.58,40.95 46.58,40.95 45.92,40.28 | 45.92,40.28 44.45,38.81 C26.2 44.35,38.71 43.43,37.8 39.37,37.8 C25.- | SJ2.2 28.7,82.5 29.62,81.58 29.62,78.54 29.01,77.93 21.89,77.93 19.15,75.18 19.15,58.12 21.18,56.08 P9.1 | U2.2 32.46,56.9 32.05,56.9 U2.1 31.95,56.79 30.94,56.79 21.29,47.14 P8.1 | U$1.GND3 54.61,4.47 53.59,4.47 46.08,11.99 44.45,11.99 U$1.GND2 | U$1.GND5 73.71,16.66 76.15,16.66 U$1.GND4 | 48.62,57.81 48.62,58.12 47.7,59.03 IC3.12 47.6,59.03 | 48.62,57.81 48.62,57 IC3.5 | 42.82,58.22 43.33,58.73 43.64,58.73 46.08,61.16 46.58,61.16 IC3.10 | 42.82,58.22 42.82,57.4 44.15,56.08 46.79,56.08 47.09,56.39 47.09,56.9 IC3.2 47.19,57 47.6,57 IC3.3 47.6,57.1 47.6,57.51 47.9,57.81 48.62,57.81 | U2.7 33.58,61.16 33.58,60.35 34.39,59.54 41.4,59.54 42.72,58.22 42.82,58.22 | 83.26,27.23 83.26,31.7 P10.1 | 83.26,27.23 83.26,26.11 P3.1 | U$4.8 75.34,72.64 78.49,72.64 R1.2 79.4,71.73 80.21,71.73 82.35,69.6 88.04,69.6 P13.1 | P4.2 92.51,82.5 92.51,76.91 P15.2 92.41,76.71 92.41,73.86 88.14,69.6 P13.1 | P1.1 88.14,52.32 88.14,58.01 P11.1 88.14,58.12 88.14,63.7 P12.1 88.14,63.8 88.14,69.39 P13.1 | U$1.GND1 90.17,23.27 92.41,25.5 92.41,26.52 91.69,27.23 83.26,27.23
  Bottom 0.254: C6.- C25.- 39.27,37.8 37.13,39.93 33.07,39.93 R21.2 32.97,40.03 28.3,40.03 21.29,47.04 P8.1 | D2.A 60.3,41.25 58.37,41.25 53.39,36.27 U$7.16 | P2.1 21.29,11.58 21.29,14.83 22.4,15.95 22.4,19.3 21.29,20.42 P5.1 21.18,20.52 20.07,21.64 20.07,27.84 21.18,28.96 21.18,29.26 P6.1 21.18,29.36 21.18,32.61 20.07,33.73 20.07,36.98 21.18,38.1 P7.1 21.18,38.3 21.18,41.45 20.07,42.57 20.07,45.92 21.18,47.04 P8.1 | P9.1 21.18,55.98 21.18,55.58 20.07,54.46 20.07,48.26 21.18,47.14 P8.1 | U$1.GND6 87.63,5.49 91.49,9.35 91.49,18.69 90.58,19.61 90.17,19.61 U$1.GND1 90.07,19.61 89.05,18.59 79.1,18.59 77.27,16.76 76.25,16.76 U$1.GND4 | U$1.GND3 54.61,4.47 55.02,4.47 67.21,16.66 73.61,16.66 U$1.GND5 | R4.2 57.15,62.79 55.93,62.79 52.27,59.13 47.7,59.13 IC3.12 | P10.1 83.36,31.8 83.36,34.44 85.19,36.27 85.19,39.32 P14.2 85.29,39.42 85.29,43.08 87.22,45.01 P16.3 87.32,45.11 87.32,51.51 88.14,52.32 P1.1 | 78.18,61.27 78.18,70.61 79.3,71.73 R1.2 | 78.18,61.27 78.18,60.35 C4.2 | 78.18,61.27 67.51,61.27 67,60.76 67,59.84 67.92,58.93 67.92,57.81 C2.2
IMU_ENABLE  (via drill 0.35)
  Top 0.254: v46.08,28.04 43.64,28.04 35.71,20.12 35.71,19.61 34.7,18.59 33.88,18.59 32.87,19.61 31.75,19.61 U$1.32-OUT1B
  Bottom 0.254: v46.08,28.04 65.48,28.04 76.76,39.32 83.26,39.32 P14.1
LED_PWM
  Top 0.254: U$1.5-IN2 74.93,38.41 82.65,46.13 82.65,60.96 74.73,68.89 74.73,72.64 U$4.7
MAG_INT
  Top 0.254: U$1.3-LRCLK2 80.01,41.76 83.26,45.01 P16.1
MAG_SCL
  Bottom 0.254: U$1.16-A2/RX4/SCL1 64.77,4.37 65.28,4.37 66.7,2.95 74.93,2.95 76.35,4.37 76.35,4.88 76.96,5.49 83.06,5.49 83.97,4.57 83.97,4.06 84.68,3.35 88.44,3.35 89.05,3.96 89.05,6.3 93.62,10.87 93.62,40.74 89.36,45.01 P16.4
MAG_SDA  (via drill 0.35)
  Top 0.254: v90.78,18.39 92.81,20.42 92.81,43.48 91.29,45.01 P16.5
  Bottom 0.254: v90.78,18.39 88.04,15.65 78.49,15.65 67.31,4.47 U$1.17-A3/TX4/SDA1
MISO
  Bottom 0.254: U$1.12-MISO/MQSL 57.15,19.61 58.27,19.61 59.28,18.59 65.18,18.59 66.19,19.61 66.19,20.12 70.97,24.89 84.07,24.89 85.19,26.01 P3.2
MISO1
  Bottom 0.254: U$1.41-A17/MISO1 52.07,4.47 52.68,4.47 65.99,17.78 77.06,17.78 78.89,19.61 78.89,20.12 82.45,23.67 91.8,23.67 93.22,25.09 93.22,32 91.9,33.33 86.82,33.33 85.29,31.8 P10.2
MOSI
  Top 0.254: U$1.11-MOSI/CTX1 59.69,19.61 60.81,19.61 62.23,18.19 71.27,18.19 71.68,18.59 80.42,18.59 81.43,19.61 81.43,20.22 87.22,26.01 P3.3
MOSI1
  Bottom 0.254: U$1.26-A12/MOSI1 46.99,19.71 48.01,19.71 54,25.7 80.72,25.7 85.6,30.58 86.11,30.58 87.22,31.7 P10.3
N$1
  Bottom 0.254: R7.2 52.07,55.27 53.29,55.27 55.73,57.71 64.77,57.71 C1.1
N$2
  Top 0.254: U$4.9 75.34,78.54 78.49,78.54 79.3,79.35 R1.1
N$3
  Top 0.254: R8.2 81.94,79.45 87.32,79.45 90.37,82.5 P4.1
N$4
  Top 0.254: IC3.7 48.21,61.16 48.21,60.55 48.41,60.35 49.53,60.35 54.61,55.27 R10.1
N$5
  Top 0.254: U2.3 32.97,56.9 32.97,41.35 30.84,39.22 30.84,23.16 34.29,19.71 U$1.31-CTX3
N$6
  Top 0.254: 71.78,72.75 71.98,72.75 U$4.3 | 71.78,72.75 71.48,72.75 U$4.2 | 73.91,73.15 73.91,72.75 U$4.6 | 73.61,73.46 73.91,73.15 | 73.61,73.46 72.39,73.46 71.78,72.85 71.78,72.75 | U$4.15 71.48,78.44 71.98,78.44 U$4.14 72.08,78.33 72.08,78.03 72.49,77.62 73.61,77.62 | 73.61,77.62 73.91,77.93 73.91,78.44 U$4.11 | 73.61,77.62 73.61,73.46 | R8.1 81.84,71.83 80.72,71.83 79.1,73.46 74.32,73.46 74.02,73.15 73.91,73.15
N$8
  Top 0.254: U$8.4 71.17,61.67 71.17,61.06 72.9,59.33 80.31,59.33 81.23,60.25 C3.2
N$9
  Top 0.254: U$1.6-OUT1D 72.39,36.27 71.17,37.49 71.17,56.39 U$8.5
N$10  (via drill 0.35)
  Top 0.254: 49.48,55.02 50.24,54.25 56.24,54.25 57.15,55.17 R4.1 | 49.48,55.02 48.21,56.29 48.21,56.9 IC3.4 | v46.69,34.44 46.69,31.9 46.79,31.8 46.79,27.74 46.38,27.33 45.47,27.33 37.85,19.71 36.83,19.71 U$1.30-CRX3 | 49.48,55.02 v48.82,54.36
  Bottom 0.254: v46.69,34.44 46.69,52.22 v48.82,54.36
N$17
  Top 0.254: R5.2 38.05,55.27 36.42,56.9 34.09,56.9 U2.5 34.09,57 34.09,57.61 33.68,58.01 30.53,58.01 20.07,47.55 20.07,24.79 35.41,9.45 35.41,4.37 37.24,2.54 69.44,2.54 71.27,4.37 72.39,4.37 U$1.19-A5/SCL0
N$18
  Top 0.254: U2.9 32.56,61.27 32.56,72.24 30.53,74.27 28.7,74.27 SJ5.1
N$22  (via drill 0.35)
  Top 0.254: 39.68,54.25 35.41,54.25 33.58,56.08 33.58,56.9 U2.4 | 39.68,54.25 40.59,55.17 R2.2 | 39.68,54.25 v39.68,42.16
  Bottom 0.254: v39.68,42.16 40.49,41.35 40.49,19.3 39.68,18.49 39.68,12.8 44.04,8.43 44.55,8.43 48.11,4.88 48.11,4.37 49.12,3.35 55.42,3.35 55.73,3.66 55.73,4.57 57.05,5.89 64.87,5.89 65.89,4.88 65.89,4.37 66.9,3.35 67.72,3.35 68.73,4.37 69.85,4.37 U$1.18-A4/SDA0
N$24
  Top 0.254: C19.1 46.38,60.35 46.89,60.35 47.09,60.55 47.09,61.16 IC3.9
N$26
  Top 0.254: C19.2 45.47,61.98 47.4,61.98 47.6,61.77 47.6,61.27 IC3.8 | SJ3.1 27.18,71.73 25.35,71.73 20.37,66.75 LED3.A
  Bottom 0.254: C19.2 43.74,60.35 32.16,60.35 25.86,66.65 20.37,66.65 LED3.A
N$30
  Top 0.254: R15.1 59.69,55.17 58.47,55.17 56.95,53.65 43.64,53.65 38.15,59.13 25.35,59.13 20.37,64.11 LED3.K
N$39
  Bottom 0.254: LED1.K 66.6,72.95 66.6,58.22 63.65,55.27 62.23,55.27 R9.1
N$42
  Top 0.254: U$7.11 53.39,39.01 53.39,38.61 54.51,37.49 55.32,37.49 60.3,32.51 60.3,31.19 D2.C 60.4,31.09 61.93,29.57 68.53,29.57 L2.1
N$46
  Top 0.254: U$7.5 53.9,33.33 53.9,33.83 52.78,34.95 49.02,34.95 48.31,35.66 36.32,35.66 33.07,32.41 R21.1
N$47
  Top 0.254: R20.2 48.51,39.12 51.36,39.12 U$7.14
  Bottom 0.254: P15.1 90.37,76.81 90.37,73.36 79.1,62.08 79.1,59.94 77.88,58.73 70.87,58.73 52.17,40.03 47.7,40.03 R20.2
O1_RX
  Top 0.254: U$1.0-RX1/CS1/CRX2 87.63,16.15 76.05,4.57 76.05,4.06 74.12,2.13 28.6,2.13 21.29,9.45 P2.2
O1_TX
  Top 0.254: U$1.1-TX1/MISO1/CTX2 85.09,19.71 86.11,19.71 87.12,20.73 88.14,20.73 88.75,20.12 88.75,15.95 78.59,5.79 78.59,4.06 76.25,1.73 26.98,1.73 21.29,7.42 P2.3
O2_RX  (via drill 0.35)
  Top 0.254: U$1.7-RX2/OUT1A 69.85,29.87 58.37,41.35 39.57,41.35 31.55,33.33 v31.55,27.13 | v23.52,19.1 21.89,19.1 21.29,18.49 P5.2
  Bottom 0.254: v23.52,19.1 v31.55,27.13
O2_TX  (via drill 0.35)
  Top 0.254: v63.45,21.03 64.97,21.03 66.29,19.71 67.31,19.71 U$1.8-TX2/IN1 | v32.77,18.19 v40.39,18.19 | v23.52,18.19 23.01,18.19 21.29,16.46 P5.3
  Bottom 0.254: v63.45,21.03 54.41,21.03 53.19,19.81 53.19,19.3 52.07,18.19 v40.39,18.19 | v23.52,18.19 v32.77,18.19
O3_RX
  Bottom 0.254: U$1.15-A1/RX3/SPDIF_IN 62.23,4.37 61.11,4.37 58.88,2.13 35.1,2.13 32.87,4.37 32.87,7.82 22.81,17.88 22.81,25.7 21.29,27.23 P6.2
O3_TX  (via drill 0.35)
  Top 0.254: v35,12.9 33.58,12.9 21.29,25.2 P6.3
  Bottom 0.254: v35,12.9 43.03,4.88 43.03,4.37 44.86,2.54 57.35,2.54 59.18,4.37 59.69,4.37 U$1.14-A0/TX3/SPDIF_OUT
O4_RX
  Bottom 0.254: U$1.34-RX8 34.29,18.19 32.87,19.61 32.87,26.82 23.52,36.17 21.29,36.17 P7.2
O4_TX
  Top 0.254: U$1.35-TX8 36.83,12.5 22.4,26.92 22.4,33.02 21.29,34.14 P7.3
O5_RX
  Bottom 0.254: U$1.21-A7/RX5/BCLK1 77.47,4.37 76.96,4.37 75.13,2.54 65.18,2.54 63.35,4.37 63.35,4.88 62.74,5.49 59.18,5.49 58.27,4.57 58.27,4.06 57.15,2.95 46.99,2.95 45.57,4.37 45.57,4.88 44.55,5.89 44.04,5.89 35.41,14.53 35.41,28.65 22.4,41.66 22.4,43.89 21.29,45.01 P8.2
O5_TX
  Top 0.254: U$1.20-A6/TX5/LRCLK1 74.93,4.47 73.91,4.47 72.9,5.49 61.72,5.49 60.81,4.57 60.81,4.06 59.69,2.95 41.91,2.95 40.49,4.37 40.49,9.45 22.81,27.13 22.81,41.45 21.29,42.98 P8.3
O6_RX  (via drill 0.35)
  Top 0.254: v45.57,23.67 49.53,19.71 U$1.25-A11/RX6/SDA2
  Bottom 0.254: v45.57,23.67 45.57,26.92 41.3,31.19 41.3,42.16 29.52,53.95 21.29,53.95 P9.2
O6_TX
  Bottom 0.254: U$1.24-A10/TX6/SCL2 52.07,19.61 50.95,19.61 49.94,18.59 46.58,18.59 45.57,19.61 45.57,21.64 40.89,26.31 40.89,41.96 30.94,51.92 21.29,51.92 P9.3
POWER+  (via drill 0.35)
  Top 1.575: v30.23,73.05 29.01,71.83 28.7,71.83 SJ3.2 | C13.1 13.97,54.76 CON8.+ 13.97,53.95 C12.1 13.97,45.11 CON7.+ 13.97,44.3 C11.1 13.97,36.98 CON5.+ 13.97,36.17 C10.1 13.97,27.33 CON4.+ 13.97,26.52 C9.1 13.97,19.2 CON6.+ 13.97,18.39 C16.1 13.97,9.55 CON2.+
  Bottom 1.575: U$5.3 54.81,86.36 52.17,89 48.11,89 46.69,87.58 46.69,87.07 U$2.3 43.43,86.36 40.79,83.72 36.73,83.72 35,85.45 U$3.3 34.9,86.36 30.23,81.69 v30.23,73.05 29.92,72.34 29.92,69.49 28.91,68.48 19.56,68.48 13.97,62.89 C13.1
RXD  (via drill 0.35)
  Top 0.254: v69.14,27.13 46.79,27.13 39.37,19.71 U$1.29-TX7 | v81.84,32 89.26,39.42 P14.4
  Bottom 0.254: v69.14,27.13 76.96,27.13 v81.84,32
SCK
  Top 0.254: U$1.13-SCK/LED 57.15,4.47 58.17,4.47 71.88,18.19 82.55,18.19 83.97,19.61 83.97,20.12 88.75,24.89 90.07,24.89 91.19,26.01 P3.5
SCK1  (via drill 0.35)
  Top 0.254: U$1.27-A13/SCK1 44.45,23.57 45.26,24.38 66.8,24.38 v69.14,22.05
  Bottom 0.254: v69.14,22.05 75.13,22.05 77.57,24.49 91.39,24.49 92.41,25.5 92.41,30.58 91.29,31.7 P10.5
SENS1
  Top 0.254: U$1.22-A8/CTX1 80.01,6.6 93.22,19.81 93.22,51.31 92.2,52.32 P1.3
SENS2
  Top 0.254: U$1.23-A9/CRX1/MCLK1 82.55,8.53 93.62,19.61 93.62,56.59 92.2,58.01 P11.3
SENS3  (via drill 0.35)
  Top 0.254: U$1.38-A14/CS/IN1 44.45,5.49 43.33,6.6 43.33,12.9 43.94,13.51 52.48,13.51 58.57,19.61 58.57,20.12 59.18,20.73 62.74,20.73 63.65,19.81 63.65,19.3 64.36,18.59 70.26,18.59 70.97,19.3 70.97,37.08 v70.46,37.59
  Bottom 0.254: v70.46,37.59 70.46,48.36 81.43,59.33 87.73,59.33 92.1,63.7 P12.3
SENS4  (via drill 0.35)
  Top 0.254: v45.57,22.66 45.57,19.3 44.86,18.59 44.35,18.59 42.93,17.17 42.93,6.4 43.03,6.3 43.03,4.37 44.04,3.35 44.86,3.35 45.87,4.37 46.99,4.37 U$1.39-A15/CS/OUT1A
  Bottom 0.254: v45.57,22.66 46.28,23.37 46.28,26.82 45.36,27.74 45.36,28.35 46.89,29.87 64.06,29.87 91.08,56.9 92.71,56.9 93.32,57.51 93.32,68.28 92.2,69.39 P13.3
TXD  (via drill 0.35)
  Top 0.254: U$1.28-RX7 41.91,21.64 46.69,26.42 v67.41,26.42 | v84.48,36.58 87.22,39.32 P14.3
  Bottom 0.254: v67.41,26.42 77.57,36.58 v84.48,36.58
V+  (via drill 0.35)
  Top 0.254: 32.05,60.35 32.05,61.16 U2.10 31.95,61.27 28.6,64.62 v28.6,70.1 | 32.05,60.35 32.26,60.15 32.77,60.15 33.07,60.45 33.07,61.16 U2.8 | v28.7,78.64 SJ1.2 | v51.97,37.69 51.97,39.01 U$7.13 | C25.+ 39.37,39.73 38.96,39.73 32.05,32.82 32.05,32 32.66,31.39 42.22,31.39 44.45,33.63 C26.1 | v31.65,59.84 32.05,60.25 32.05,60.35
  Bottom 0.254: v28.7,78.64 28.7,70.21 v28.6,70.1 | v51.97,37.69 51.97,36.68 47.7,32.41 R20.1 47.5,32.41 46.28,33.63 44.45,33.63 C26.1 44.35,33.73 43.43,34.65 43.43,40.64 31.65,52.43 v31.65,59.84

### Text on the board
tNames: 1.0 | Cerebellar